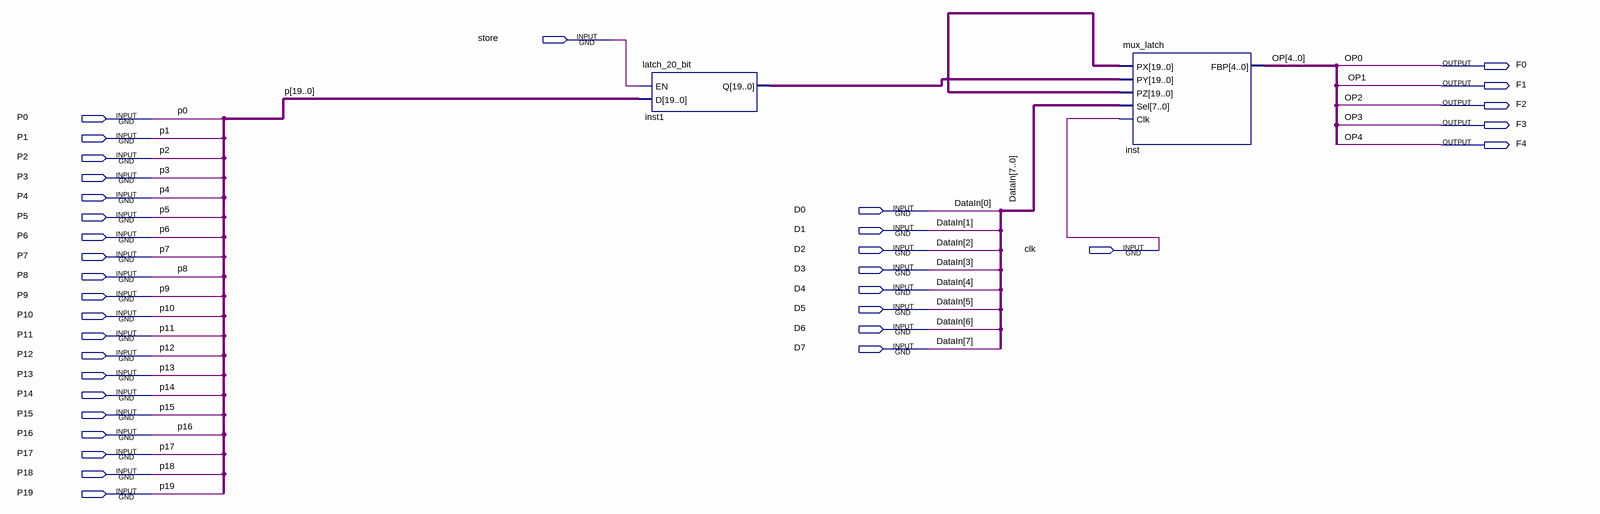
[diagram p0: schematic sheet]
// Quartus schematic mux_latch_test.bdf as structural Verilog: 2 symbols, 35 pins
module mux_latch_test (
  input  store,
  input  P0,
  input  P1,
  input  P2,
  input  P3,
  input  P4,
  input  D0,
  input  P5,
  input  D1,
  input  P6,
  input  D2,
  input  clk,
  input  P7,
  input  D3,
  input  P8,
  input  D4,
  input  P9,
  input  D5,
  input  P10,
  input  D6,
  input  P11,
  input  D7,
  input  P12,
  input  P13,
  input  P14,
  input  P15,
  input  P16,
  input  P17,
  input  P18,
  input  P19,
  output F0,
  output F1,
  output F2,
  output F3,
  output F4
);

  wire [19:0] inst1_q;

  latch_20_bit inst1 (
    .EN(store),
    .D({P19, P18, P17, P16, P15, P14, P13, P12, P11, P10, P9, P8, P7, P6, P5, P4, P3, P2, P1, P0}),
    .Q(inst1_q));
  mux_latch inst (
    .PX(inst1_q), .PY(inst1_q), .PZ(inst1_q), .Sel({D7, D6, D5, D4, D3, D2, D1, D0}), .Clk(clk),
    .FBP({F4, F3, F2, F1, F0}));

  // Other names for the same wires on the sheet: DataIn[7:0] = {D7, D6, D5, D4, D3, D2, D1, D0};
  //   OP[4:0] = {F4, F3, F2, F1, F0}; OP0 = F0; OP1 = F1; OP2 = F2; OP3 = F3; OP4 = F4
endmodule
